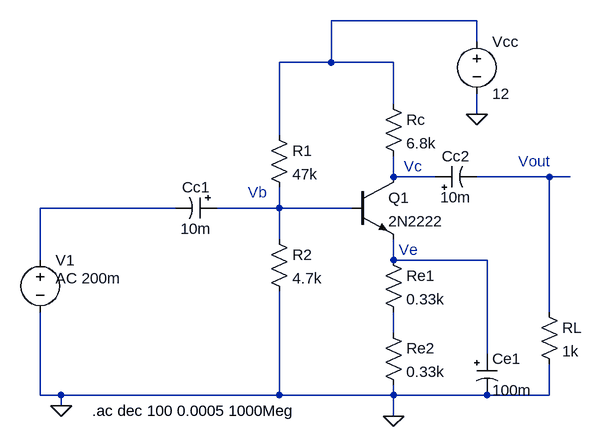
[diagram p0: schematic Draft11.asc]
Draft11.asc, the LTspice schematic file:
Version 4
SHEET 1 880 680
WIRE 448 -192 224 -192
WIRE 448 -160 448 -192
WIRE 224 -128 224 -192
WIRE 224 -128 144 -128
WIRE 320 -128 224 -128
WIRE 320 -64 320 -128
WIRE 448 -48 448 -80
WIRE 144 -16 144 -128
WIRE 320 48 320 16
WIRE 384 48 320 48
WIRE 560 48 448 48
WIRE 592 48 560 48
WIRE -16 96 -224 96
WIRE 144 96 144 64
WIRE 144 96 48 96
WIRE 256 96 144 96
WIRE 144 144 144 96
WIRE -224 176 -224 96
WIRE 320 176 320 144
WIRE 464 176 320 176
WIRE 560 256 560 48
WIRE 320 288 320 256
WIRE 464 320 464 176
WIRE -224 384 -224 256
WIRE -192 384 -224 384
WIRE 144 384 144 224
WIRE 144 384 -192 384
WIRE 320 384 320 368
WIRE 320 384 144 384
WIRE 464 384 320 384
WIRE 560 384 560 336
WIRE 560 384 464 384
WIRE -192 400 -192 384
WIRE 320 416 320 384
FLAG 320 416 0
FLAG 448 -48 0
FLAG -192 400 0
SYMBOL res 128 -32 R0
SYMATTR InstName R1
SYMATTR Value 47k
SYMBOL res 128 128 R0
SYMATTR InstName R2
SYMATTR Value 4.7k
SYMBOL npn 256 48 R0
SYMATTR InstName Q1
SYMATTR Value 2N2222
SYMBOL res 304 160 R0
SYMATTR InstName Re1
SYMATTR Value 0.33k
SYMBOL res 304 272 R0
SYMATTR InstName Re2
SYMATTR Value 0.33k
SYMBOL res 304 -80 R0
SYMATTR InstName Rc
SYMATTR Value 6.8k
SYMBOL voltage -224 160 R0
WINDOW 123 24 44 Left 2
WINDOW 39 0 0 Left 0
WINDOW 3 24 44 Left 2
SYMATTR Value2 AC 200m
SYMATTR Value ""
SYMATTR InstName V1
SYMBOL polcap 48 80 R90
WINDOW 0 0 32 VBottom 2
WINDOW 3 32 32 VTop 2
SYMATTR InstName Cc1
SYMATTR Value 10m
SYMBOL polcap 448 320 R0
SYMATTR InstName Ce1
SYMATTR Value 100m
SYMBOL voltage 448 -176 R0
WINDOW 123 0 0 Left 0
WINDOW 39 0 0 Left 0
SYMATTR InstName Vcc
SYMATTR Value 12
SYMBOL polcap 384 64 R270
WINDOW 0 32 32 VTop 2
WINDOW 3 0 32 VBottom 2
SYMATTR InstName Cc2
SYMATTR Value 10m
SYMBOL res 544 240 R0
SYMATTR InstName RL
SYMATTR Value 1k
TEXT 96 72 Left 2 ;Vb
TEXT 336 32 Left 2 ;Vc
TEXT 328 160 Left 2 ;Ve
TEXT 512 24 Left 2 ;Vout
TEXT -144 408 Left 2 !.ac dec 100 0.0005 1000Meg

The netlist it stands for:
* Draft11.asc
R1 N001 N005 47k
R2 N005 0 4.7k
Q1 N002 N005 N006 0 2N2222
Re1 N006 N007 0.33k
Re2 N007 0 0.33k
Rc N001 N002 6.8k
V1 N004 0 AC 200m
Cc1 N005 N004 10m
Ce1 N006 0 100m
Vcc N001 0 12
Cc2 N002 N003 10m
RL N003 0 1k
.model NPN NPN
.model PNP PNP
.lib standard.bjt
* Vb
* Vc
* Ve
* Vout
.ac dec 100 0.0005 1000Meg
.backanno
.end